# Altium schematic sheet PowerSupply.SchDoc
size A; SheetNumber: 1; SheetTotal: 1
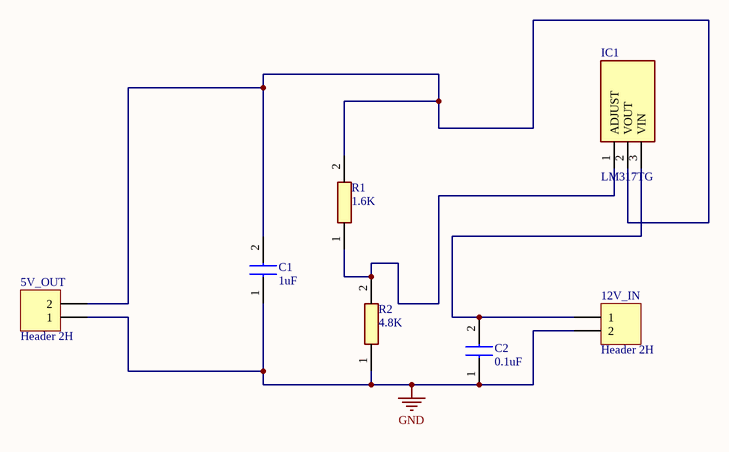
[diagram p0: PowerSupply.SchDoc]

## Parts
5V_OUT  Header 2H  [HDR1X2H]
12V_IN  Header 2H  [HDR1X2H]
C1  1uF  [CAPC2012X145N]
C2  0.1uF  [CAPC2012X88N]
IC1  LM317TG  [TO254P482X997X2018-3P]
R1  1.6K  [ERA6A_(0805)]
R2  4.8K  [ERA6VK]

## Nets
GND: 5V_OUT.1 12V_IN.2 C1.1 C2.1 R2.1
Net5V_OUT_2: 5V_OUT.2 C1.2 IC1.2(VOUT) R1.2
Net12V_IN_1: 12V_IN.1 C2.2 IC1.3(VIN)
NetIC1_1: IC1.1(ADJUST) R1.1 R2.2

## Library data of the parts
5V_OUT 12V_IN = Header 2H: Header, 2-Pin, Right Angle; LatestRevisionDate: 17-Jul-2002; LatestRevisionNote: Re-released for DXP Platform.; Publisher: Altium Limited
C1 = CGA4J1X8L1H105K125AE: Capacitor; Manufacturer_Name: TDK; Datasheet Link: https://product.tdk.com/system/files/dam/doc/product/capacitor/ceramic/mlcc/catalog/mlcc_automotive_soft_en.pdf; Height: 1.45mm; Manufacturer_Part_Number: CGA4J1X8L1H105K125AE; Mouser Part Number: 810-CGA4J1X8L1H10512; Mouser Price/Stock: https://www.mouser.co.uk/ProductDetail/TDK/CGA4J1X8L1H105K125AE?qs=zW32dvEIR3sNqGICW%2F0Hww%3D%3D; Arrow Part Number: CGA4J1X8L1H105K125AE; Arrow Price/Stock: https://www.arrow.com/en/products/cga4j1x8l1h105k125ae/tdk?region=nac
C2 = C0805C104K8RACAUTO: Capacitor; Manufacturer_Name: Kemet; Datasheet Link: https://ad.componentsearchengine.com/Datasheets/2/C0805C104K8RACAUTO.pdf; Height: 0.88mm; Manufacturer_Part_Number: C0805C104K8RACAUTO; Mouser Part Number: 80-C0805C104K8RAUTO; Mouser Price/Stock: https://www.mouser.co.uk/ProductDetail/KEMET/C0805C104K8RACAUTO?qs=ds50AKTGxA8vmn6TMGYnqg%3D%3D
IC1 = LM317TG: Integrated Circuit; Manufacturer_Name: ON Semiconductor; Datasheet Link: http://www.onsemi.com/pub/Collateral/LM317-D.PDF; Height: 4.82mm; Manufacturer_Part_Number: LM317TG; Mouser Part Number: 863-LM317TG; Mouser Price/Stock: https://www.mouser.co.uk/ProductDetail/onsemi/LM317TG?qs=2OtswVQKCOFN3Xj61Z7S9w%3D%3D; Arrow Part Number: LM317TG; Arrow Price/Stock: https://www.arrow.com/en/products/lm317tg/on-semiconductor?region=europe
R1 = ERA-6ARB162V: Resistor; Manufacturer_Name: Panasonic; Datasheet Link: http://industrial.panasonic.com/cdbs/www-data/pdf/RDM0000/AOA0000C307.pdf; Height: 0.6mm; Manufacturer_Part_Number: ERA-6ARB162V; Mouser Part Number: 667-ERA-6ARB162V; Mouser Price/Stock: https://www.mouser.com/Search/Refine.aspx?Keyword=667-ERA-6ARB162V
R2 = ERA-6VEB4702V: Resistor; Manufacturer_Name: Panasonic; Datasheet Link: http://industrial.panasonic.com/cdbs/www-data/pdf/RDM0000/RDM0000C331.pdf; Height: 0.65mm; Manufacturer_Part_Number: ERA-6VEB4702V; Mouser Part Number: 667-ERA-6VEB4702V; Mouser Price/Stock: https://www.mouser.co.uk/ProductDetail/Panasonic/ERA-6VEB4702V?qs=rI7uf1IzohRM7rriIYHLwg%3D%3D; Arrow Part Number: ERA-6VEB4702V; Arrow Price/Stock: https://www.arrow.com/en/products/era-6veb4702v/panasonic?region=nac